# EAGLE design Model52 (EAGLE 6.6.0)
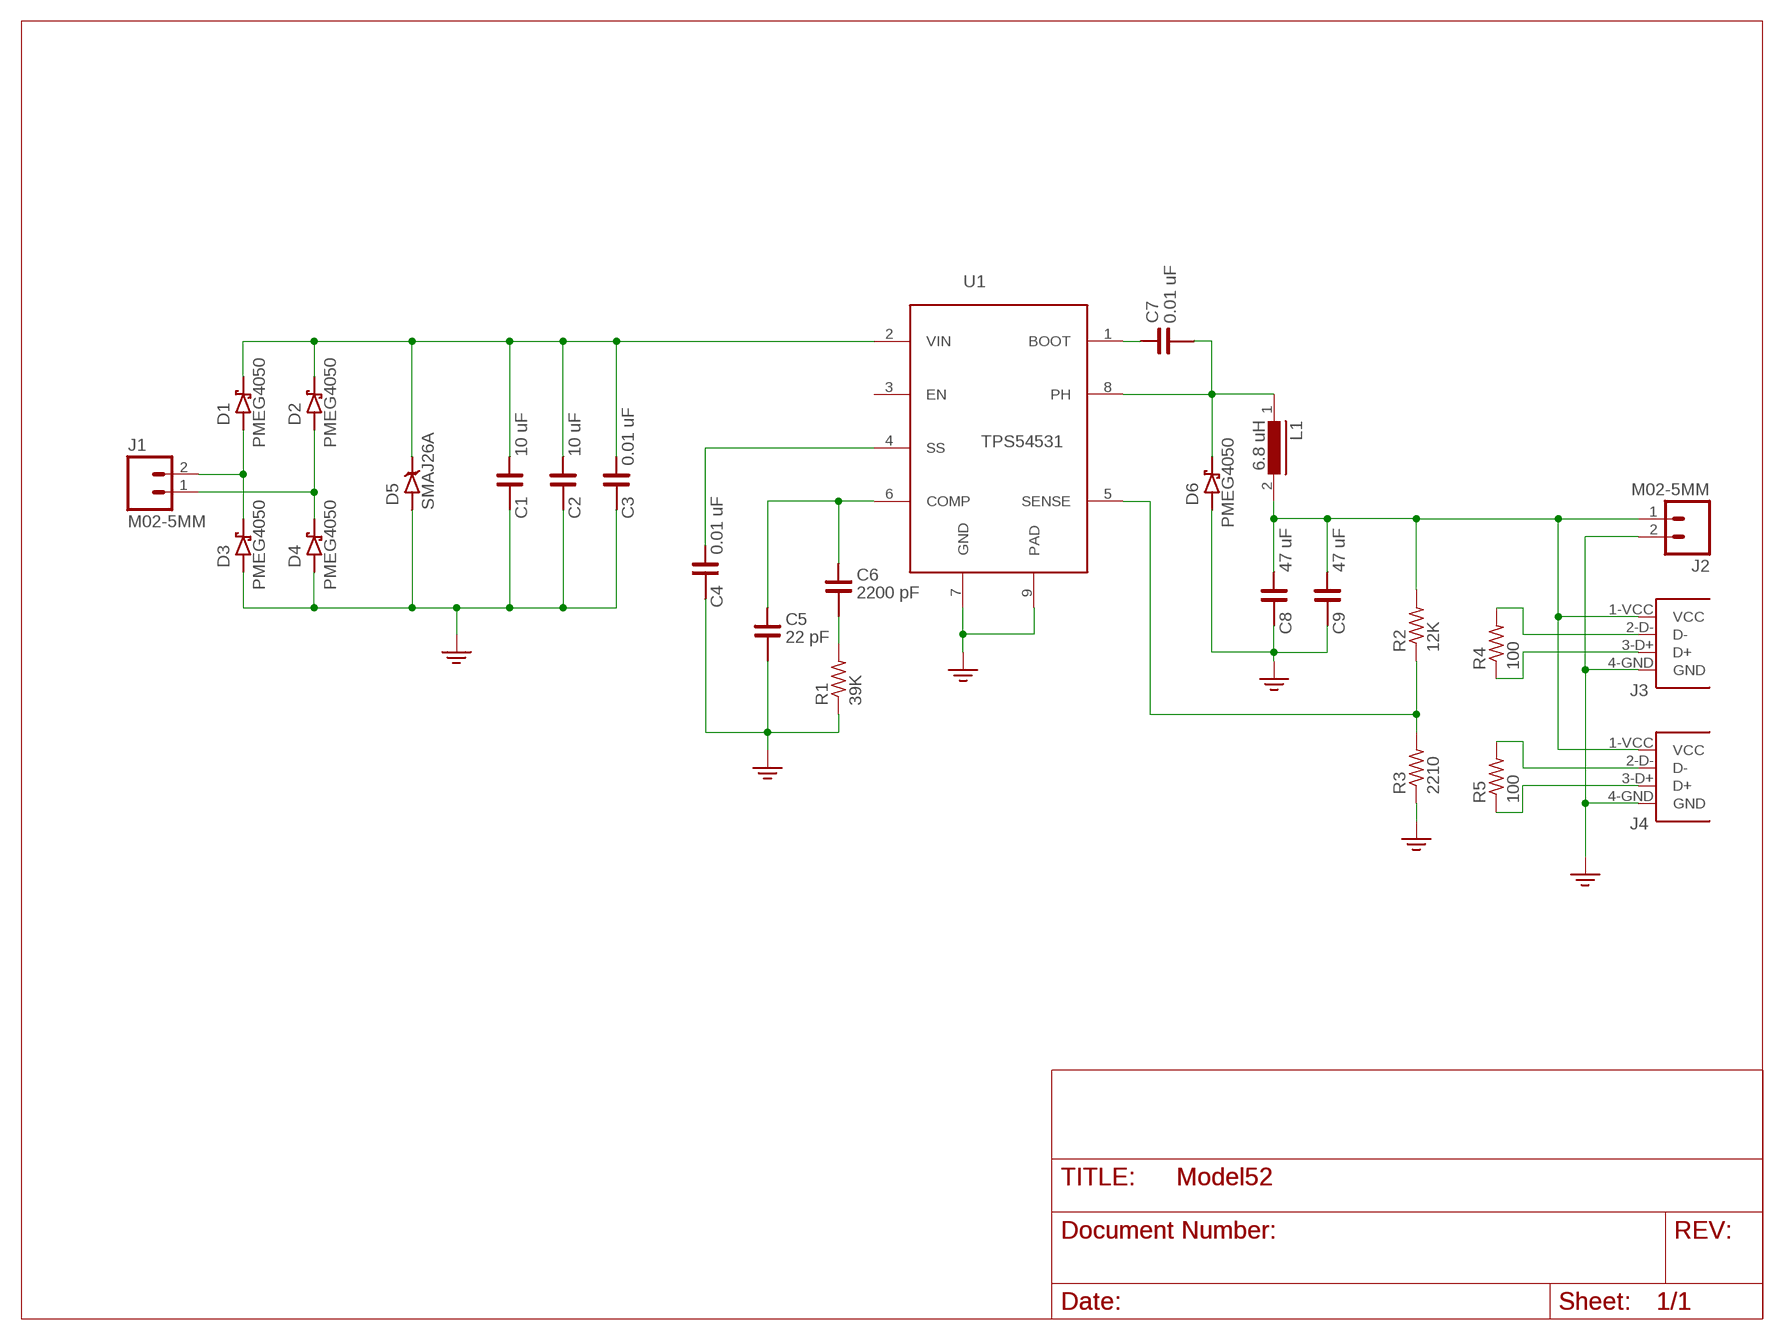
[diagram p0: schematic, sheet 1]

## Parts
C1  10 uF  CN-1210  [1210]
C2  10 uF  CN-1210  [1210]
C3  0.01 uF  CN-0805  [0805]
C4  0.01 uF  CN-0805  [0805]
C5  22 pF  CN-0805  [0805]
C6  2200 pF  CN-0805  [0805]
C7  0.01 uF  CN-0805  [0805]
C8  47 uF  CN-1206  [C1206]
C9  47 uF  CN-1206  [C1206]
D1  PMEG4050EP  [SOD128]
D2  PMEG4050EP  [SOD128]
D3  PMEG4050EP  [SOD128]
D4  PMEG4050EP  [SOD128]
D5  SMAJ26A  [DO214BA]
D6  PMEG4050EP  [SOD128]
J1  M02-5MM  [SCREWTERMINAL-5MM-2]
J2  M02-5MM  [SCREWTERMINAL-5MM-2]
J3  87520-USB-A-FEMALE  [87520-USB-A-FEMALE]
J4  87520-USB-A-FEMALE  [87520-USB-A-FEMALE]
L1  6.8 uH  DR125  [DR125]
R1  39K  R-US_R0805  [R0805]
R2  12K  R-US_R0805  [R0805]
R3  2210  R-US_R0805  [R0805]
R4  100  R-US_R0805  [R0805]
R5  100  R-US_R0805  [R0805]
U1  TPS54531  [SOIC127P600X170-9N]

## Nets
5V [power]: C8.1 C9.1 J2.1 J3.1-VCC(VCC) J4.1-VCC(VCC) L1.2 R2.2
AC1 [power]: D1.P$1A D3.P$2C J1.2
AC2 [power]: D2.P$1A D4.P$2C J1.1
BOOT: C7.1 U1.1(BOOT)
COMP: C5.1 C6.1 U1.6(COMP)
D+: J4.3-D+(D+) R5.1
D-: J4.2-D-(D-) R5.2
GND [power]: C1.2 C2.2 C3.2 C4.2 C5.2 C8.2 C9.2 D3.P$1A D4.P$1A D5.A(P$1A) D6.P$1A J2.2 J3.4-GND(GND) J4.4-GND(GND) R1.1 R3.1 U1.7(GND) U1.9(PAD)
N$1: C6.2 R1.2
N$7: J3.3-D+(D+) R4.1
N$11: J3.2-D-(D-) R4.2
SENSE: R2.1 R3.2 U1.5(SENSE)
SLOW: C4.1 U1.4(SS)
VIN [power]: C1.1 C2.1 C3.1 D1.P$2C D2.P$2C D5.C(P$2C) U1.2(VIN)
VSW [power]: C7.2 D6.P$2C L1.1 U1.8(PH)
Unconnected: U1.3(EN)

## Library data of the parts
C1 C2 = passives:CN-1210
C3-C7 = passives:CN-0805
C8 C9 = passives:CN-1206
D1-D4 D6 = semi:PMEG4050EP
D5 = semi:SMAJ26A
J1 J2 = mech:M02-5MM
J3 J4 = mech:87520-USB-A-FEMALE
L1 = inductors:DR125: High Power Density, High Efficiency, Shielded Inductors Source: coiltronics_dr_series.pdf
R1-R5 = resistor:R-US_: RESISTOR, American symbol
U1 = semi:TPS54531

## Net classes
1 ground: width 0.813 mm, drill 0.61 mm, clearance 0.305 mm
2 power: width 0.813 mm, drill 0.61 mm, clearance 0.305 mm

## Board
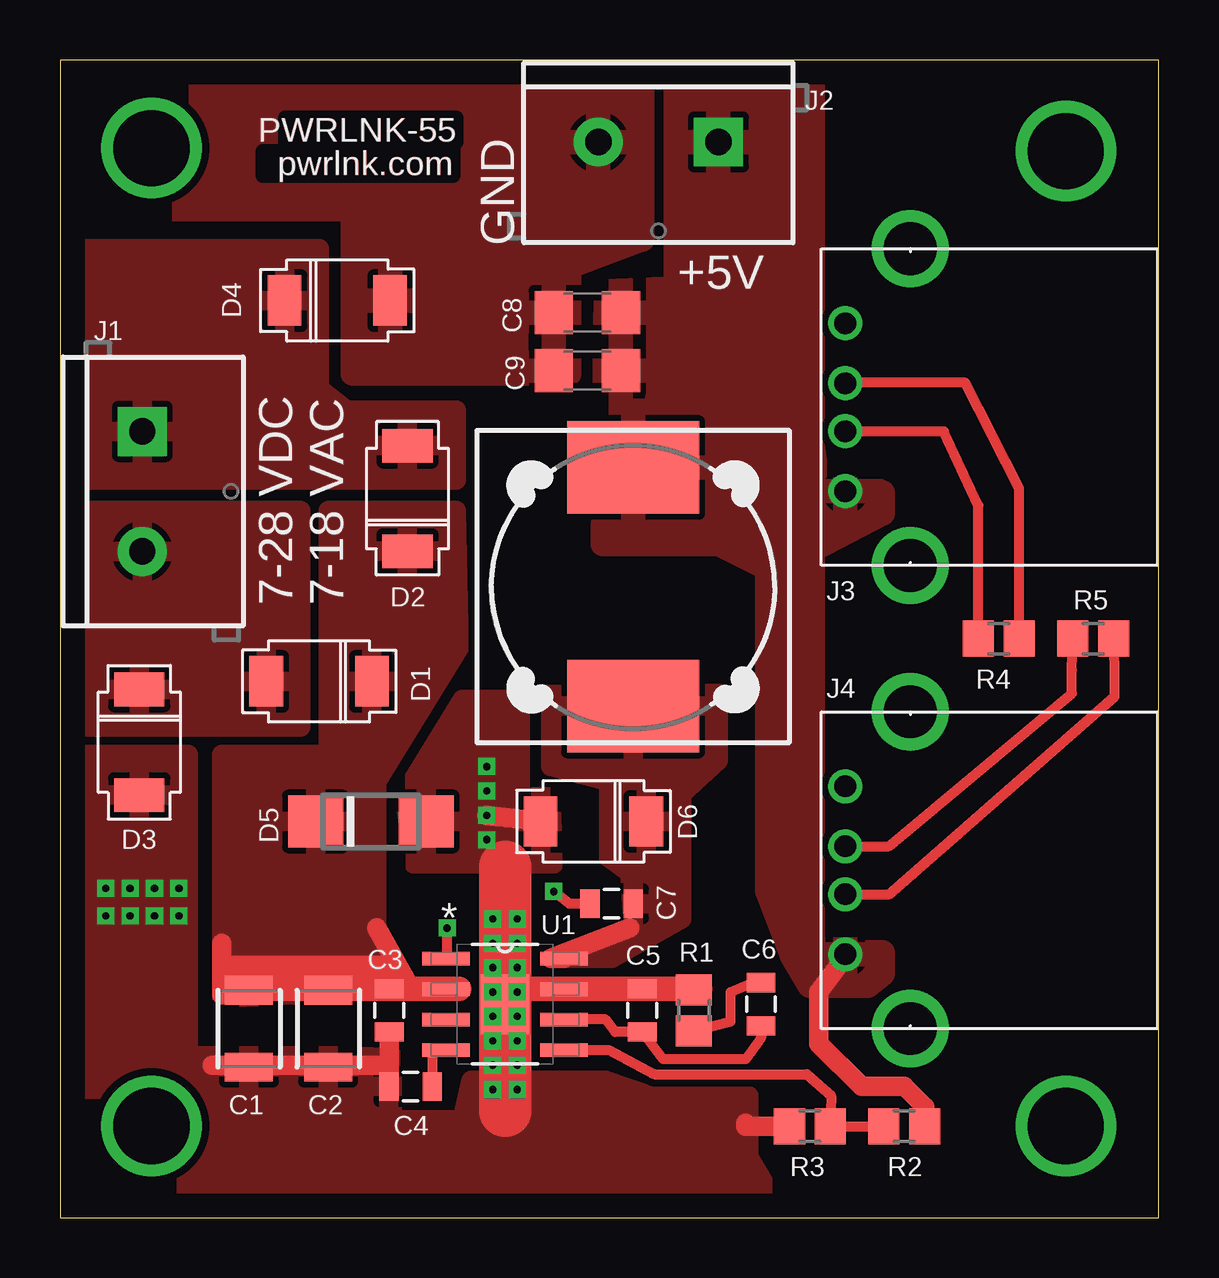
[diagram p1: board, top side]
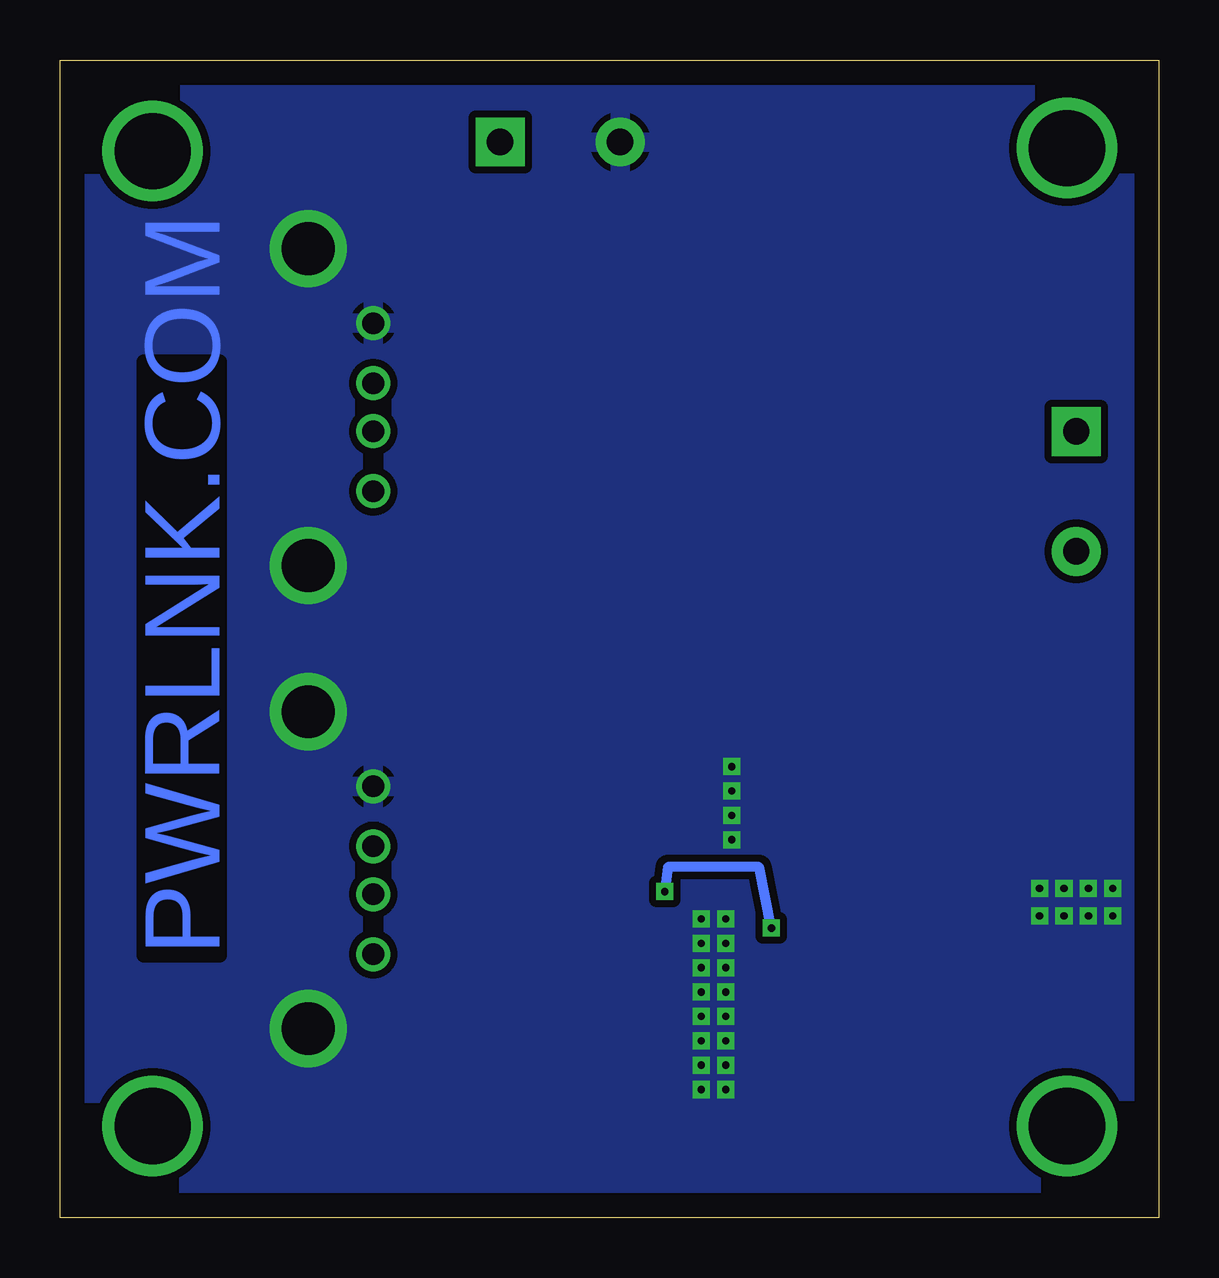
[diagram p2: board, bottom side, seen from below]

Size 45.77 x 48.25 mm. Coordinates in mm from the lower left corner, seen from the top.
Outline: 0,0 45.77,0 45.77,48.25 0,48.25 0,0
Copper layers (1*16): Top 0.035mm / dielectric 1.5mm / Bottom 0.035mm
Design rules "default *": minimum track width 10mil, minimum drill 18mil, track to track 8mil, track to pad 8mil, pad to pad 8mil, via to via 8mil, smd to smd 8mil, copper to edge 40mil, drill to drill 8mil, minimum pad ring 10mil, minimum via ring 8mil, stop-mask expansion 4mil, vias tented up to drill 0mil, thermal gap 10mil

### Footprints (pad centres in the part's own frame; a part is rotated, then mirrored left to right if it is on the bottom)
1210 = smd 1.2 x 2: 1 -1.6,0; 2 1.6,0
0805 = smd 0.8 x 1.2: 1 -0.9,0; 2 0.9,0
C1206 = smd 1.6 x 1.8: 1 -1.4,0; 2 1.4,0
SOD128 = smd 1.4 x 2.1: P$1A -2.2,0; P$2C 2.2,0
DO214BA = smd 2.286 x 2.159: A 2.304,0; C -2.304,0
SCREWTERMINAL-5MM-2 = drill 1.1 pad 2.032 square: 1 0,0 | drill 1.1 pad 2.032: 2 5,0
87520-USB-A-FEMALE = drill 0.9: 1-VCC 3.1,13; 2-D- 5.6,13; 3-D+ 7.6,13; 4-GND 10.1,13
DR125 = smd 3.85 x 5.5: 1 -4.975,0; 2 4.975,0
R0805 = smd 1.3 x 1.5: 1 -0.85,0; 2 0.85,0
SOIC127P600X170-9N = smd 1.981 x 0.559: 1 -2.464,1.905; 2 -2.464,0.635; 3 -2.464,-0.635; 4 -2.464,-1.905; 5 2.464,-1.905; 6 2.464,-0.635; 7 2.464,0.635; 8 2.464,1.905 | smd 2.007 x 2.489: 9 0,0

### Placement (x,y rotation side)
C1  7.87,7.87 270 top
C2  11.18,7.87 270 top
C3  13.72,8.64 270 top
C4  14.61,5.46 180 top
C5  24.26,8.64 90 top
C6  29.21,8.89 90 top
C7  22.99,13.08 0 top
C8  21.97,37.72 180 top
C9  21.97,35.31 180 top
D1  10.79,22.35 0 top
D2  14.48,29.97 270 top
D3  3.3,19.81 90 top
D4  11.56,38.23 180 top
D5  12.95,16.51 0 top
D6  22.23,16.51 0 top
J1  3.43,32.77 270 top
J2  27.43,44.83 180 top
J3  45.72,27.18 90 top
J4  45.72,7.87 90 top
L1  23.88,26.29 90 top
R1  26.42,8.64 270 top
R2  35.18,3.81 0 top
R3  31.24,3.81 0 top
R4  39.12,24.13 180 top
R5  43.05,24.13 0 top
U1  18.54,8.89 0 top

### Tracks (layer width: path | path; a pad name or v marks a point on that pad's centre or on a via)
5V
  Top 0.406: 32.64,10.92 32.72,10.92 J4.1-VCC
  Top 0.813: R2.2 36.03,4.61 35.18,5.46 33.4,5.46 31.62,7.24 31.62,9.4 32.77,10.93 J4.1-VCC
  pour Top: 25.65,47.88 25.65,38.73 22.73,38.61 22.61,28.07 27.43,28.07 29.46,27.05 29.46,13.59 30.48,10.92 31.24,9.65 33.66,9.65 34.29,10.16 34.29,11.05 33.91,11.18 31.37,11.18 31.37,27.81 34.29,29.34 34.29,30.23 34.04,30.35 31.62,30.35 31.37,32.13 31.37,47.88
AC1
  pour Top: 0.51,29.46 0.38,20.45 10.03,20.45 10.03,29.46
AC2
  pour Top: 0.51,40.39 10.79,40.39 10.79,34.54 11.94,33.66 16.51,33.66 16.51,30.73 0.51,30.73
BOOT  (via drill 0.3)
  Top 0.406: U1.1 16.13,10.79 | 16.26,10.79 16.13,10.79 | 16.13,10.79 v16.13,12.06 | C7.1 21.21,13.08 v20.57,13.59
  Bottom 0.406: v16.13,12.06 16.64,14.61 20.45,14.61 v20.57,13.59
COMP
  Top 0.406: C6.1 29.21,7.49 28.57,6.6 25.14,6.6 C5.1 23.12,7.74 22.73,8.26 U1.6
D+
  Top 0.406: J4.3-D+ 34.52,15.47 42.16,21.84 42.16,22.82 R5.1
D-
  Top 0.406: J4.2-D- 34.56,13.47 43.94,21.72 43.94,22.9 R5.2
GND  (via drill 0.3, 2.2)
  Top 0.406: U1.9 18.54,9.4 v19.05,9.4 19.05,9.53 18.92,9.53 | 26.42,9.54 26.42,9.53 R1.1
  Top 0.813: v17.78,16.76 D6.P$1A 19.94,16.76 | 6.35,6.35 13.72,6.35 | 13.72,6.35 C3.2 | 13.72,6.35 13.71,5.59 C4.2 | C5.2 26.42,9.54 | R3.1 28.57,3.81 28.57,3.94
  Top 1.016: 18.92,9.53 U1.7 26.42,9.53 26.67,9.53
  Top 2.184: 18.54,14.61 U1.9 18.54,4.45
  other vias: 18.03,12.45 18.03,9.4 19.05,8.38 18.03,8.38 19.05,12.45 19.05,10.41 18.03,10.41 19.05,7.37 18.03,7.37 18.03,11.43 19.05,11.43 18.03,6.35 19.05,6.35 19.05,5.33 35.43,7.87 35.43,21.08 35.43,27.18 35.43,40.39 17.78,15.75 17.78,17.78 17.78,18.8 18.03,5.33 1.91,13.72 2.92,13.72 3.94,13.72 4.95,13.72 1.91,12.57 2.92,12.57 3.94,12.57 4.95,12.57
  pour Bottom: 0.38,47.88 45.34,47.75 45.34,0.38 0.38,0.38
  pour Top: 28.7,5.08 24.64,5.08 22.73,5.71 17.14,5.71 16.76,4.06 13.84,4.06 13.84,6.73 5.33,6.73 5.33,19.3 0.38,19.3 0.25,0.25 29.97,0.38 28.7,2.54
  pour Top: 12.19,35.18 12.19,42.04 0.64,42.04 0.64,47.75 24.26,47.75 24.26,40.77 21.21,39.62 21.21,35.18
  pour Top: 14.35,17.65 14.73,14.73 20.57,14.73 20.45,17.53 19.18,17.53 19.18,21.59 16.76,21.59
N$1
  Top 0.406: R1.2 27.94,8.17 27.94,9.4 28.83,9.78 C6.2
N$3  (via drill 3.17)
  other vias: 3.81,3.81
N$4  (via drill 3.17)
  other vias: 41.91,3.81
N$6  (via drill 3.17)
  other vias: 3.81,44.58
N$7
  Top 0.406: R4.1 39.97,30.39 37.72,34.8 32.74,34.8 J3.3-D+
N$8  (via drill 3.17)
  other vias: 41.91,44.45
N$11
  Top 0.406: R4.2 38.27,29.68 36.83,32.77 32.73,32.77 J3.2-D-
SENSE
  Top 0.406: U1.5 22.86,6.99 24.77,5.97 31.11,5.97 32.13,5.08 R3.2 R2.1
SLOW
  Top 0.406: 16.2,6.99 U1.4 15.51,6.99 C4.1
VIN
  Top 0.813: 14.61,9.53 13.21,12.06 | 7.37,9.53 7.87,9.53 C1.1 | C2.1 13.72,9.47 C3.1 13.84,9.54 | 13.84,9.54 13.84,9.53 | 13.84,9.54 13.84,10.41 | 6.73,9.27 6.73,11.43
  Top 1.016: 16.64,9.53 U1.2 14.61,9.53 13.84,9.53 7.37,9.53 | 13.97,10.41 13.84,10.41 7.11,10.41
  pour Top: 11.18,19.3 11.18,29.46 16.51,29.46 16.64,23.75 13.21,18.16 13.21,9.4 6.73,9.14 6.73,19.3
VSW
  Top 0.813: 23.75,12.06 20.45,10.79 U1.8
  pour Top: 20.45,21.84 27.43,21.84 27.43,19.05 25.91,17.65 25.91,12.45 22.99,10.79 20.45,10.79 22.86,11.43 23.88,12.06 23.75,14.35 22.86,14.99 22.86,18.16 20.45,18.8

### Text on the board
Top: PWRLNK-55 | pwrlnk.com
Bottom: PWRLNK.COM
tNames: PWRLNK-55 | pwrlnk.com | GND | +5V | 7-28 VDC / 7-18 VAC